# Altium schematic sheet Gate_Control.SchDoc
size Letter
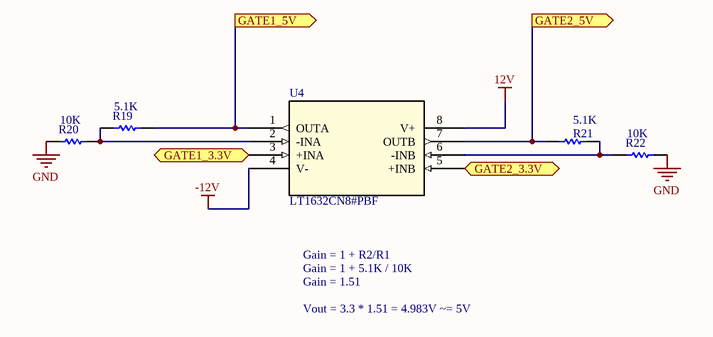
[diagram p0: Gate_Control.SchDoc]

## Parts
R19  value 5.1K  [AXIAL-0.3]  (hidden comment: Res1)
R20  value 10K  [AXIAL-0.3]  (hidden comment: Res1)
R21  value 5.1K  [AXIAL-0.3]  (hidden comment: Res1)
R22  value 10K  [AXIAL-0.3]  (hidden comment: Res1)
U4  LT1632CN8#PBF  [PDIP-8_N]

## Ports
GATE1_3.3V (in), GATE1_5V (out), GATE2_3.3V (in), GATE2_5V (out)

## Nets
12V: U4.8(V+)
-12V: U4.4(V-)
GND: R20.1 R22.2
GATE1_3.3V: U4.3(+INA) ; port GATE1_3.3V
GATE1_5V: R19.2 U4.1(OUTA) ; port GATE1_5V
GATE2_3.3V: U4.5(+INB) ; port GATE2_3.3V
GATE2_5V: R21.1 U4.7(OUTB) ; port GATE2_5V
NetR19_1: R19.1 R20.2 U4.2(-INA)
NetR21_2: R21.2 R22.1 U4.6(-INB)

## Notes on the sheet
- Gain = 1 + R2/R1
- Gain = 1 + 5.1K / 10K
- Gain = 1.51
- Vout = 3.3 * 1.51 = 4.983V ~= 5V

## Library data of the parts
R19-R22 = Res1: Resistor; Published: 8-Jun-2000; LatestRevisionDate: 17-Jul-2002; LatestRevisionNote: Re-released for DXP Platform.; PackageReference: AXIAL-0.3; Publisher: Altium Limited; PackageDescription: Axial Device, Thru-Hole; 2 Leads; 0.3 in Pin Spacing
U4 = LT1632CN8#PBF: Imported; Operating_Temperature: 0Â°C ~ 70Â°C; Current_-_Output_/_Channel: 70mA; Voltage_-_Input_Offset: 500ÂµV; Current_-_Input_Bias: 1.15ÂµA; Output_Type: Rail-to-Rail; Vendor: Linear Technology; Amplifier_Type: General Purpose; Number_of_Circuits: 2; Slew_Rate: 45 V/Âµs; Gain_Bandwidth_Product: 45MHz; Current_-_Supply: 4.6mA; Current_-_Output/Channel: 40mA; Voltage_-_Supply,_Single/Dual_(Â±): 2.7 V ~ 36 V, Â±1.35 V ~ 18 V; Mounting_Type: Through Hole; 3D_Library_Name: Maxim2; C: Copyright (C) 2016 Accelerated Designs. All rights reserved; -3db_Bandwidth: -; Series: *; Manufacturer_Part_Number: LT1632CN8#PBF; DigiKeyPartNumber: LT1632CN8-ND; Quantity_Available: 0; DataSheet: http://www.linear.com/docs/3055; Packaging: Tube; Package_/_Case: 8-DIP (0.300", 7.62mm); Copyright: Copyright (C) 2015 Accelerated Designs. All rights reserved; Supplier_Device_Package: 8-PDIP; Value: Value; Type: Type; RefDes: RefDes